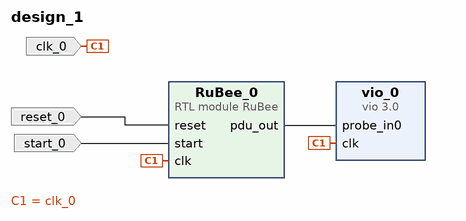
[diagram p0: block diagram of the top level]
# Vivado block design design_1, xc7a35tcpg236-1, Vivado 2024.1
create_bd_design design_1

create_bd_port -dir I -type clk clk_0
create_bd_port -dir I -type rst reset_0
create_bd_port -dir I start_0

create_bd_cell -type module -reference RuBee RuBee_0
create_bd_cell -type ip -vlnv xilinx.com:ip:vio:3.0 vio_0
set_property -dict {CONFIG.C_NUM_PROBE_OUT 0} [get_bd_cells vio_0]

# ---- connections ----

connect_bd_net [get_bd_pins RuBee_0/pdu_out] [get_bd_pins vio_0/probe_in0]
connect_bd_net -net clk_0_1 [get_bd_ports clk_0] [get_bd_pins vio_0/clk] [get_bd_pins RuBee_0/clk]
connect_bd_net -net reset_0_1 [get_bd_ports reset_0] [get_bd_pins RuBee_0/reset]
connect_bd_net -net start_0_1 [get_bd_ports start_0] [get_bd_pins RuBee_0/start]

validate_bd_design
save_bd_design
